# Altium schematic sheet PDU.SchDoc
size 279 x 215 mm; SheetNumber: 2; SheetTotal: 2
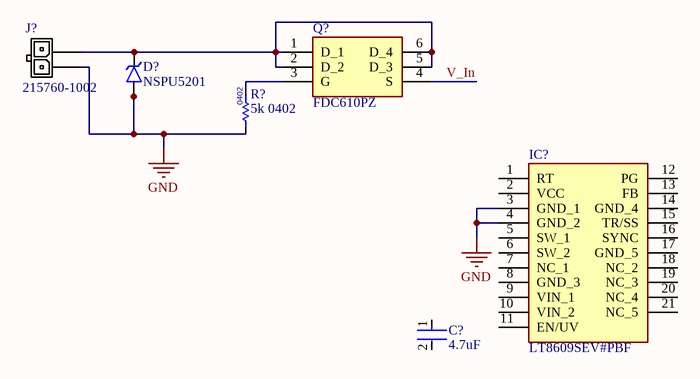
[diagram p0: PDU.SchDoc]

## Parts
C?  4.7uF  [FP-GRM188-0_2-IPC_C]
D?  NSPU5201  [NSPM5131MUTBG]
IC?  LT8609SEV#PBF  [LT8609SEVPBF]
J?  215760-1002  [215760-1002-Footprint-1]
Q?  FDC610PZ  [SOT95P280X110-6N]
R?  5k 0402  [Res0402-Type-1]

## Nets
GND: D?.5(GND_(A)_1) D?.6(GND_(A)_2) D?.7(GND_(A)_3) D?.8(GND_(A)_4) IC?.3(GND_1) IC?.4(GND_2) J?.2 R?.1
V_In: Q?.4(S)
NetD?_1: D?.1 D?.2 J?.1 Q?.1(D_1) Q?.2(D_2) Q?.5(D_3) Q?.6(D_4)
NetQ?_3: Q?.3(G) R?.2

Not connected (* = marked no-connect by the designer): C? 1 2; IC? 1(RT) 2(VCC) 5(SW_1) 6(SW_2) 7(NC_1) 8(GND_3) 9(VIN_1) 10(VIN_2) 11(EN/UV) 12(PG) 13(FB) 14(GND_4) 15(TR/SS) 16(SYNC) 17(GND_5) 18(NC_2) 19(NC_3) 20(NC_4) 21(NC_5)

## Notes on the sheet
- Title
- Designer
- Revision
- Date:
- File:
- (in symbol CMP-Res-00031-1) 0402

## Library data of the parts
C? = CMP-2006-02545-2: Chip Multilayer Ceramic Capacitors for General Purpose, 0603, 4.7uF, X5R, 15%, 10%, 35V / GRM188R6YA475KE15D; Lead Free: Lead Free; Max Operating Temperature: 85°C; Case Code (Imperial): 0603; Capacitance: 4.7uF; Width: 0.8mm; Thickness: 0.031inch; Case Code (Metric): 1608; Min Operating Temperature: -55°C; Voltage Rating (DC): 35V; Dielectric: X5R; Voltage: 35V; Packaging: Tape and Reel; Resistor Type: Ceramic; Weight: 0.000222oz; Mount: Surface Mount; Material: Ceramic; Depth: 0.8mm; Tolerance: 10%; REACH SVHC: No SVHC; Case/Package: 0603; Voltage Rating: 35V; Package Quantity: 4000; Height: 0.8mm; Length: 1.6mm; Termination: SMD/SMT
D? = CMP-004-000061-2: Unidirectional High Voltage ESD and Surge Protection; Provides ESD Protection to IEC6100042 Level 4: +/-30 kV Contact Discharge; Small Package: 1.8 mm x 2.0 mm; These Devices are PbFree; Manufacturer_Name: onsemi; Arrow Part Number: NSPU5201MUTBG; Design Item ID: NSPU5201MUTBG; Source: SamacSys.SchLib; Mouser Price/Stock: https://www.mouser.co.uk/ProductDetail/ON-Semiconductor/NSPU5201MUTBG?qs=byeeYqUIh0OtIrNH4%2Fsnzg%3D%3D; Mouser Part Number: 863-NSPU5201MUTBG; Height: 0mm; Datasheet Link: https://www.onsemi.com/pub/Collateral/NSPU5201-D.PDF; Manufacturer_Part_Number: NSPU5201MUTBG; Arrow Price/Stock: https://www.arrow.com/en/products/nspu5201mutbg/on-semiconductor
IC? = LT8609SEV#PBF: Integrated Circuit; Manufacturer_Name: Analog Devices; Datasheet Link: http://www.analog.com/media/en/technical-documentation/data-sheets/8609Sf.pdf; Height: 1mm; Manufacturer_Part_Number: LT8609SEV#PBF; Mouser Part Number: 584-LT8609SEVPBF; Mouser Price/Stock: https://www.mouser.co.uk/ProductDetail/Analog-Devices/LT8609SEVPBF?qs=BZBei1rCqCCvvHT89A2j%2FQ%3D%3D; Arrow Part Number: LT8609SEV#PBF; Arrow Price/Stock: https://www.arrow.com/en/products/lt8609sevpbf/analog-devices?utm_currency=USD&region=nac
J? = CMP-007-000050-6: Micro-Fit+ Right-Angle Header, 3.00mm Pitch, Single Row, 2 Circuits, Matte Tin (Sn) Plating, UL 94V-0, Glow-Wire Capable, Black; Manufacturer 1: Molex; Number of Contacts: 2; Manufacturer Part Number 1: 215760-1002; Number of Rows: 1
Q? = FDC610PZ: MOSFET (P-Channel); Manufacturer_Name: onsemi; Datasheet Link: https://www.onsemi.com/pub/Collateral/FDC610PZ-D.PDF; Height: 1.1mm; Manufacturer_Part_Number: FDC610PZ; Mouser Part Number: 512-FDC610PZ; Mouser Price/Stock: https://www.mouser.co.uk/ProductDetail/onsemi-Fairchild/FDC610PZ?qs=6olcXJbp99R1vIAdhgXLVw%3D%3D; Arrow Part Number: FDC610PZ; Arrow Price/Stock: https://www.arrow.com/en/products/fdc610pz/on-semiconductor
R? = CMP-Res-00031-1: Fixed Resistor, Metal Glaze/thick Film, 0.0625W, 5000ohm, 50V, 1% +/-Tol, 100ppm/Cel, Surface Mount, 0402; Power: 63mW; Resistance: 5k; Tolerance: 1%